# EasyEDA schematic SCH_555-circuit_2025-10-18 by abd-Ur-rehman.json
TITLE: vw circut; REV: 1.0; Date: 2025-10-18; Sheet: 1/1; Drawn By: mohammadabdurstar375; Company: Abd-Ur-Rehman
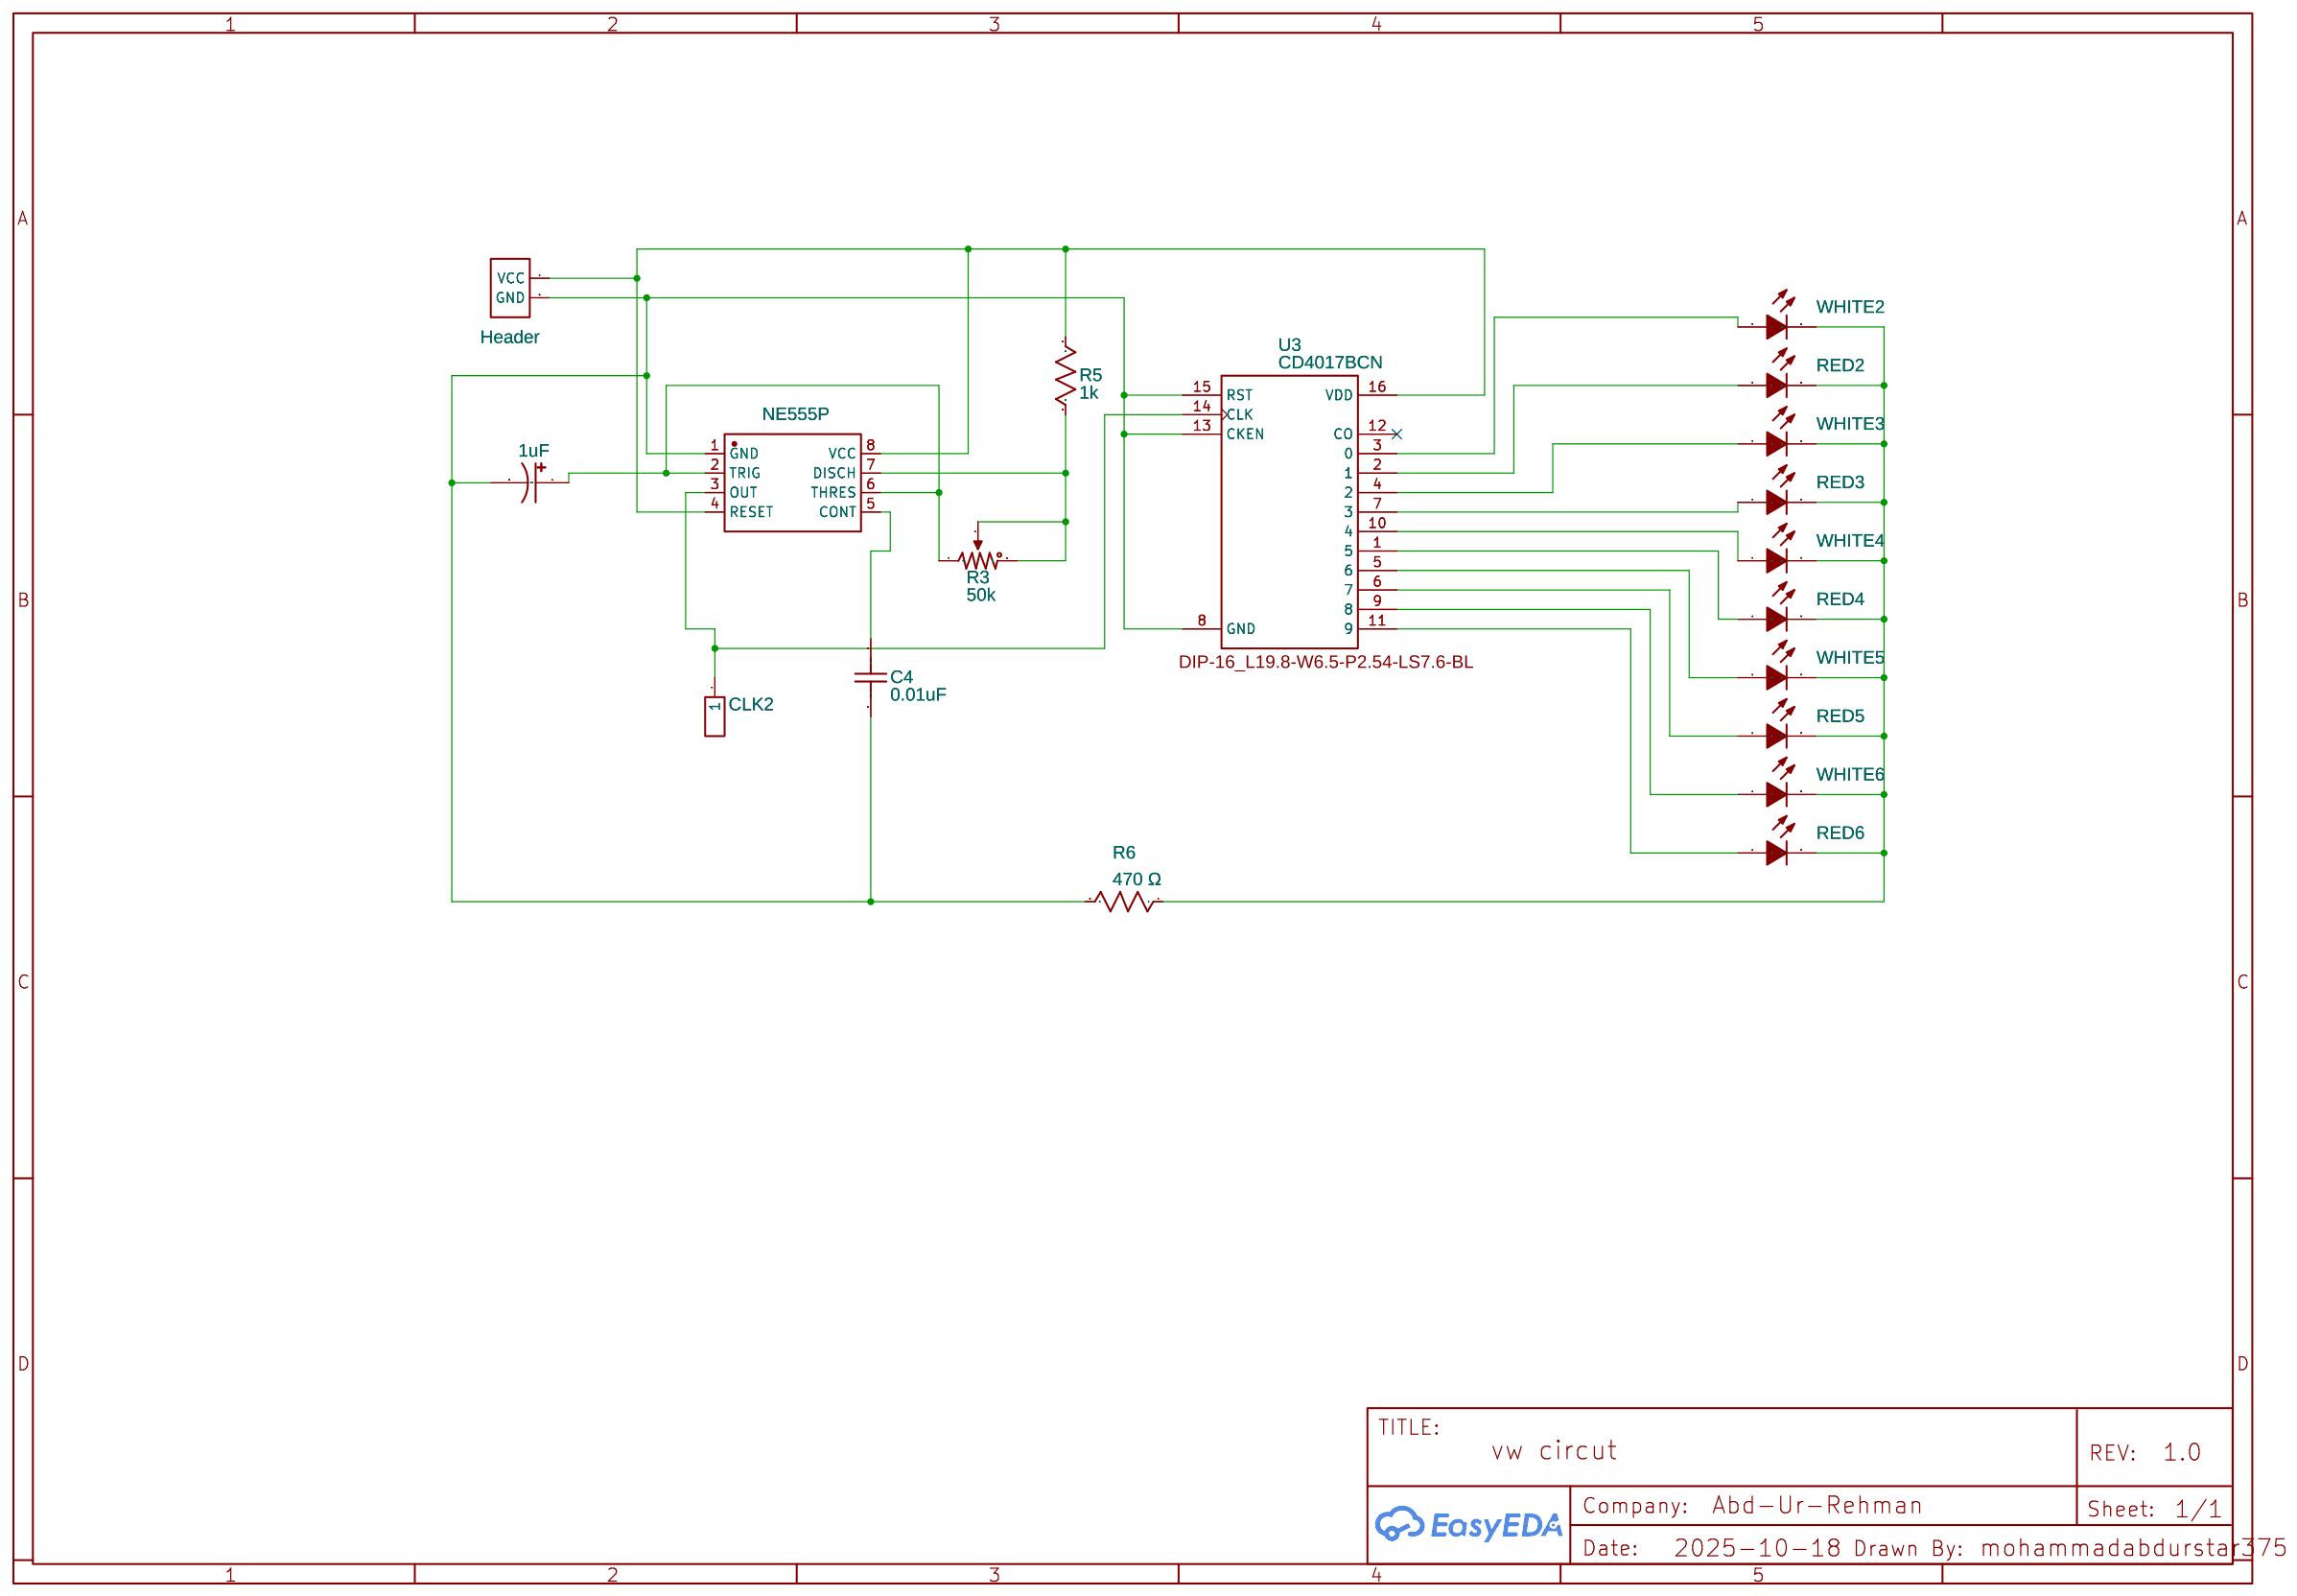
[diagram p0: schematic sheet]

## Parts
C3  1uF  [CAP-TH_BD5.0-P2.00-D0.8-FD]
C4  0.01uF  [C0603]
CLK2  C81276  [HDR-TH_1P-P2.54-V-M]
H2  Header  [HDR-M-2.54_1X2]
R3  50k  [RES-ADJ-3296X]
R5  1k  [R_AXIAL-0.3]
R6  470 Ω  [R_AXIAL-0.3]
RED2  LED_5MM  [LED-TH_BD5.0-P2.54-FD_C9900023552]
RED3  LED_5MM  [LED-TH_BD5.0-P2.54-FD_C9900023552]
RED4  LED_5MM  [LED-TH_BD5.0-P2.54-FD_C9900023552]
RED5  LED_5MM  [LED-TH_BD5.0-P2.54-FD_C9900023552]
RED6  LED_5MM  [LED-TH_BD5.0-P2.54-FD_C9900023552]
U1  NE555P  [DIP-8_L9.8-W6.6-P2.54-LS7.6-BL]
U3  CD4017BCN  [DIP-16_L19.8-W6.5-P2.54-LS7.6-BL]
WHITE2  LED_5MM  [LED-TH_BD5.0-P2.54-FD_C9900023552]
WHITE3  LED_5MM  [LED-TH_BD5.0-P2.54-FD_C9900023552]
WHITE4  LED_5MM  [LED-TH_BD5.0-P2.54-FD_C9900023552]
WHITE5  LED_5MM  [LED-TH_BD5.0-P2.54-FD_C9900023552]
WHITE6  LED_5MM  [LED-TH_BD5.0-P2.54-FD_C9900023552]

## Library data of the parts
C3 = UVZ1H010MDD: Contributor: LCSC; Supplier: LCSC; Supplier Part: C62934; Manufacturer: Nichicon(尼吉康)
C4 = C_0603_US: Supplier Part: C136131; Supplier: LCSC; Contributor: LCEDA_Lib
CLK2 = Header-Male-2.54_1x1: Supplier: LCSC; Manufacturer Part: 2.54-1*1P针; JLCPCB Part Class: Extended Part; Package Display: No; Manufacturer: BOOMELE(Boom Precision Elec); Contributor: Thejo Prakash
H2 = HEADER-FEMALE-2.54_1X2: Contributor: nonstop2004; Supplier: LCSC; Supplier Part: C492401; Package Display: No
R3 = Potentiometer: K(%): 50; Manufacturer Part: ?; Supplier: LCSC; Supplier Part: C118912; Package Display: No
R5 = Resistor: Manufacturer Part: ?; Supplier Part: C713997; Supplier: LCSC
R6 = Resistor: Manufacturer Part: ?; Supplier Part: C58592; Supplier: LCSC
RED2-RED6 = LED_5MM: Contributor: lcsc; Supplier: LCSC; Supplier Part: C2844743
U1 = NE555P: Supplier: LCSC; Manufacturer: TI(德州仪器); Supplier Part: C46749; JLCPCB Part Class: Extended Part
U3 = CD4017BCN: Decade CounterDivider with 10 Decoded Outputs; Supplier: LCSC; Supplier Part: C32710674; Package Display: Yes
WHITE2-WHITE6 = LED_5MM: Contributor: lcsc; Supplier: LCSC; Supplier Part: C2895480

## Nets
Net-(C3-1): C3.1 R3.1 U1.2(TRIG) U1.6(THRES)
Net-(C3-2): C3.2 C4.1 H2.2(GND) R6.2 U1.1(GND) U3.8(GND) U3.13(CKEN) U3.15(RST)
Net-(C4-2): C4.2 U1.5(CONT)
Net-(CLK2-1): CLK2.1 U1.3(OUT) U3.14(CLK)
Net-(H2-1): H2.1(VCC) R5.1 U1.4(RESET) U1.8(VCC) U3.16(VDD)
Net-(R3-2): R3.2(3) R3.3(2) R5.2 U1.7(DISCH)
Net-(R6-1): R6.1 RED2.2(K) RED3.2(K) RED4.2(K) RED5.2(K) RED6.2(K) WHITE2.2(K) WHITE3.2(K) WHITE4.2(K) WHITE5.2(K) WHITE6.2(K)
Net-(RED2-1): RED2.1(A) U3.2(1)
Net-(RED3-1): RED3.1(A) U3.7(3)
Net-(RED4-1): RED4.1(A) U3.1(5)
Net-(RED5-1): RED5.1(A) U3.6(7)
Net-(RED6-1): RED6.1(A) U3.11(9)
Net-(U3-3): U3.3(0) WHITE2.1(A)
Net-(U3-4): U3.4(2) WHITE3.1(A)
Net-(U3-5): U3.5(6) WHITE5.1(A)
Net-(U3-9): U3.9(8) WHITE6.1(A)
Net-(U3-10): U3.10(4) WHITE4.1(A)

Not connected (* = marked no-connect by the designer): U3 12(CO)*
